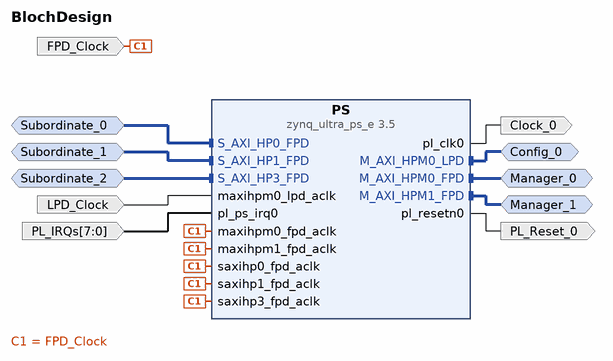
[diagram p0: block diagram of the top level]
# Vivado block design BlochDesign, xczu3eg-ubva530-2-i, Vivado 2025.1
create_bd_design BlochDesign

create_bd_intf_port -mode Slave -vlnv xilinx.com:interface:aximm_rtl:1.0 Subordinate_0
set_property -dict [list \
  CONFIG.ADDR_WIDTH 40 \
  CONFIG.ARUSER_WIDTH 0 \
  CONFIG.AWUSER_WIDTH 0 \
  CONFIG.BUSER_WIDTH 0 \
  CONFIG.DATA_WIDTH 128 \
  CONFIG.HAS_BRESP 1 \
  CONFIG.HAS_BURST 1 \
  CONFIG.HAS_CACHE 1 \
  CONFIG.HAS_LOCK 1 \
  CONFIG.HAS_PROT 1 \
  CONFIG.HAS_QOS 1 \
  CONFIG.HAS_REGION 0 \
  CONFIG.HAS_RRESP 1 \
  CONFIG.HAS_WSTRB 1 \
  CONFIG.ID_WIDTH 0 \
  CONFIG.MAX_BURST_LENGTH 256 \
  CONFIG.NUM_READ_OUTSTANDING 16 \
  CONFIG.NUM_READ_THREADS 1 \
  CONFIG.NUM_WRITE_OUTSTANDING 16 \
  CONFIG.NUM_WRITE_THREADS 1 \
  CONFIG.PROTOCOL AXI4 \
  CONFIG.READ_WRITE_MODE READ_WRITE \
  CONFIG.RUSER_BITS_PER_BYTE 0 \
  CONFIG.RUSER_WIDTH 0 \
  CONFIG.SUPPORTS_NARROW_BURST 1 \
  CONFIG.WUSER_BITS_PER_BYTE 0 \
  CONFIG.WUSER_WIDTH 0 \
] [get_bd_intf_ports Subordinate_0]
create_bd_intf_port -mode Slave -vlnv xilinx.com:interface:aximm_rtl:1.0 Subordinate_1
set_property -dict [list \
  CONFIG.ADDR_WIDTH 40 \
  CONFIG.ARUSER_WIDTH 0 \
  CONFIG.AWUSER_WIDTH 0 \
  CONFIG.BUSER_WIDTH 0 \
  CONFIG.DATA_WIDTH 128 \
  CONFIG.HAS_BRESP 1 \
  CONFIG.HAS_BURST 1 \
  CONFIG.HAS_CACHE 1 \
  CONFIG.HAS_LOCK 1 \
  CONFIG.HAS_PROT 1 \
  CONFIG.HAS_QOS 1 \
  CONFIG.HAS_REGION 0 \
  CONFIG.HAS_RRESP 1 \
  CONFIG.HAS_WSTRB 1 \
  CONFIG.ID_WIDTH 0 \
  CONFIG.MAX_BURST_LENGTH 256 \
  CONFIG.NUM_READ_OUTSTANDING 16 \
  CONFIG.NUM_READ_THREADS 1 \
  CONFIG.NUM_WRITE_OUTSTANDING 16 \
  CONFIG.NUM_WRITE_THREADS 1 \
  CONFIG.PROTOCOL AXI4 \
  CONFIG.READ_WRITE_MODE READ_WRITE \
  CONFIG.RUSER_BITS_PER_BYTE 0 \
  CONFIG.RUSER_WIDTH 0 \
  CONFIG.SUPPORTS_NARROW_BURST 1 \
  CONFIG.WUSER_BITS_PER_BYTE 0 \
  CONFIG.WUSER_WIDTH 0 \
] [get_bd_intf_ports Subordinate_1]
create_bd_intf_port -mode Slave -vlnv xilinx.com:interface:aximm_rtl:1.0 Subordinate_2
set_property -dict [list \
  CONFIG.ADDR_WIDTH 40 \
  CONFIG.ARUSER_WIDTH 0 \
  CONFIG.AWUSER_WIDTH 0 \
  CONFIG.BUSER_WIDTH 0 \
  CONFIG.DATA_WIDTH 128 \
  CONFIG.HAS_BRESP 1 \
  CONFIG.HAS_BURST 1 \
  CONFIG.HAS_CACHE 1 \
  CONFIG.HAS_LOCK 1 \
  CONFIG.HAS_PROT 1 \
  CONFIG.HAS_QOS 1 \
  CONFIG.HAS_REGION 0 \
  CONFIG.HAS_RRESP 1 \
  CONFIG.HAS_WSTRB 1 \
  CONFIG.ID_WIDTH 0 \
  CONFIG.MAX_BURST_LENGTH 256 \
  CONFIG.NUM_READ_OUTSTANDING 16 \
  CONFIG.NUM_READ_THREADS 1 \
  CONFIG.NUM_WRITE_OUTSTANDING 16 \
  CONFIG.NUM_WRITE_THREADS 1 \
  CONFIG.PROTOCOL AXI4 \
  CONFIG.READ_WRITE_MODE READ_WRITE \
  CONFIG.RUSER_BITS_PER_BYTE 0 \
  CONFIG.RUSER_WIDTH 0 \
  CONFIG.SUPPORTS_NARROW_BURST 1 \
  CONFIG.WUSER_BITS_PER_BYTE 0 \
  CONFIG.WUSER_WIDTH 0 \
] [get_bd_intf_ports Subordinate_2]
create_bd_intf_port -mode Master -vlnv xilinx.com:interface:aximm_rtl:1.0 Manager_0
set_property -dict [list \
  CONFIG.ADDR_WIDTH 40 \
  CONFIG.DATA_WIDTH 128 \
  CONFIG.HAS_REGION 0 \
  CONFIG.NUM_READ_OUTSTANDING 8 \
  CONFIG.NUM_WRITE_OUTSTANDING 8 \
  CONFIG.PROTOCOL AXI4 \
] [get_bd_intf_ports Manager_0]
create_bd_intf_port -mode Master -vlnv xilinx.com:interface:aximm_rtl:1.0 Manager_1
set_property -dict [list \
  CONFIG.ADDR_WIDTH 40 \
  CONFIG.DATA_WIDTH 128 \
  CONFIG.HAS_REGION 0 \
  CONFIG.NUM_READ_OUTSTANDING 8 \
  CONFIG.NUM_WRITE_OUTSTANDING 8 \
  CONFIG.PROTOCOL AXI4 \
] [get_bd_intf_ports Manager_1]
create_bd_intf_port -mode Master -vlnv xilinx.com:interface:aximm_rtl:1.0 Config_0
set_property -dict [list \
  CONFIG.ADDR_WIDTH 40 \
  CONFIG.DATA_WIDTH 32 \
  CONFIG.HAS_REGION 0 \
  CONFIG.NUM_READ_OUTSTANDING 8 \
  CONFIG.NUM_WRITE_OUTSTANDING 8 \
  CONFIG.PROTOCOL AXI4 \
] [get_bd_intf_ports Config_0]
create_bd_port -dir O -type clk Clock_0
create_bd_port -dir O -type rst PL_Reset_0
create_bd_port -dir I -type clk LPD_Clock
create_bd_port -dir I -from 7 -to 0 -type intr PL_IRQs
set_property -dict {CONFIG.PortWidth 8 CONFIG.SENSITIVITY EDGE_RISING} [get_bd_ports PL_IRQs]
create_bd_port -dir I -type clk FPD_Clock

create_bd_cell -type ip -vlnv xilinx.com:ip:zynq_ultra_ps_e:3.5 PS
set_property -dict [list \
  CONFIG.PSU__CRL_APB__PL0_REF_CTRL__SRCSEL DPLL \
  CONFIG.PSU__DDR_HIGH_ADDRESS_GUI_ENABLE 0 \
  CONFIG.PSU__MAXIGP0__DATA_WIDTH 128 \
  CONFIG.PSU__PSS_REF_CLK__FREQMHZ 50.0 \
  CONFIG.PSU__USE__IRQ0 1 \
  CONFIG.PSU__USE__M_AXI_GP0 1 \
  CONFIG.PSU__USE__M_AXI_GP1 1 \
  CONFIG.PSU__USE__S_AXI_GP2 1 \
  CONFIG.PSU__USE__S_AXI_GP3 1 \
  CONFIG.PSU__USE__S_AXI_GP5 1 \
] [get_bd_cells PS]
# 31 more settings of PS are not shown: defaults, MIO pin electricals, DDR timing, and values the tool derives

# ---- connections ----

connect_bd_intf_net [get_bd_intf_ports Manager_0] [get_bd_intf_pins PS/M_AXI_HPM0_FPD]
connect_bd_intf_net [get_bd_intf_ports Config_0] [get_bd_intf_pins PS/M_AXI_HPM0_LPD]
connect_bd_intf_net [get_bd_intf_ports Manager_1] [get_bd_intf_pins PS/M_AXI_HPM1_FPD]
connect_bd_intf_net -intf_net S_AXI_HP0_FPD_0_1 [get_bd_intf_ports Subordinate_0] [get_bd_intf_pins PS/S_AXI_HP0_FPD]
connect_bd_intf_net -intf_net S_AXI_HP1_FPD_0_1 [get_bd_intf_ports Subordinate_1] [get_bd_intf_pins PS/S_AXI_HP1_FPD]
connect_bd_intf_net -intf_net S_AXI_HP3_FPD_0_1 [get_bd_intf_ports Subordinate_2] [get_bd_intf_pins PS/S_AXI_HP3_FPD]
connect_bd_net [get_bd_ports FPD_Clock] \
  [get_bd_pins PS/maxihpm0_fpd_aclk] [get_bd_pins PS/maxihpm1_fpd_aclk] [get_bd_pins PS/saxihp0_fpd_aclk] \
  [get_bd_pins PS/saxihp1_fpd_aclk] [get_bd_pins PS/saxihp3_fpd_aclk]
connect_bd_net [get_bd_pins PS/pl_clk0] [get_bd_ports Clock_0]
connect_bd_net [get_bd_pins PS/pl_resetn0] [get_bd_ports PL_Reset_0]
connect_bd_net -net maxihpm0_lpd_aclk_0_1 [get_bd_ports LPD_Clock] [get_bd_pins PS/maxihpm0_lpd_aclk]
connect_bd_net -net pl_ps_irq0_0_1 [get_bd_ports PL_IRQs] [get_bd_pins PS/pl_ps_irq0]

# ---- address map ----
assign_bd_address -offset 0x0080000000 -range 64K -target_address_space [get_bd_addr_spaces PS/Data] [get_bd_addr_segs Config_0/Reg]
assign_bd_address -offset 0x00A0000000 -range 64K -target_address_space [get_bd_addr_spaces PS/Data] [get_bd_addr_segs Manager_0/Reg]
assign_bd_address -offset 0x00B0000000 -range 64K -target_address_space [get_bd_addr_spaces PS/Data] [get_bd_addr_segs Manager_1/Reg]
assign_bd_address -offset 0x0000000000 -range 2G -target_address_space [get_bd_addr_spaces Subordinate_0] [get_bd_addr_segs PS/SAXIGP2/HP0_DDR_LOW]
assign_bd_address -offset 0x00FF000000 -range 16M -target_address_space [get_bd_addr_spaces Subordinate_0] [get_bd_addr_segs PS/SAXIGP2/HP0_LPS_OCM]
assign_bd_address -offset 0x0000000000 -range 2G -target_address_space [get_bd_addr_spaces Subordinate_1] [get_bd_addr_segs PS/SAXIGP3/HP1_DDR_LOW]
assign_bd_address -offset 0x00FF000000 -range 16M -target_address_space [get_bd_addr_spaces Subordinate_1] [get_bd_addr_segs PS/SAXIGP3/HP1_LPS_OCM]
assign_bd_address -offset 0x0000000000 -range 2G -target_address_space [get_bd_addr_spaces Subordinate_2] [get_bd_addr_segs PS/SAXIGP5/HP3_DDR_LOW]
assign_bd_address -offset 0x00FF000000 -range 16M -target_address_space [get_bd_addr_spaces Subordinate_2] [get_bd_addr_segs PS/SAXIGP5/HP3_LPS_OCM]

validate_bd_design
save_bd_design
